# Altium schematic sheet Sheet1.SchDoc
size A
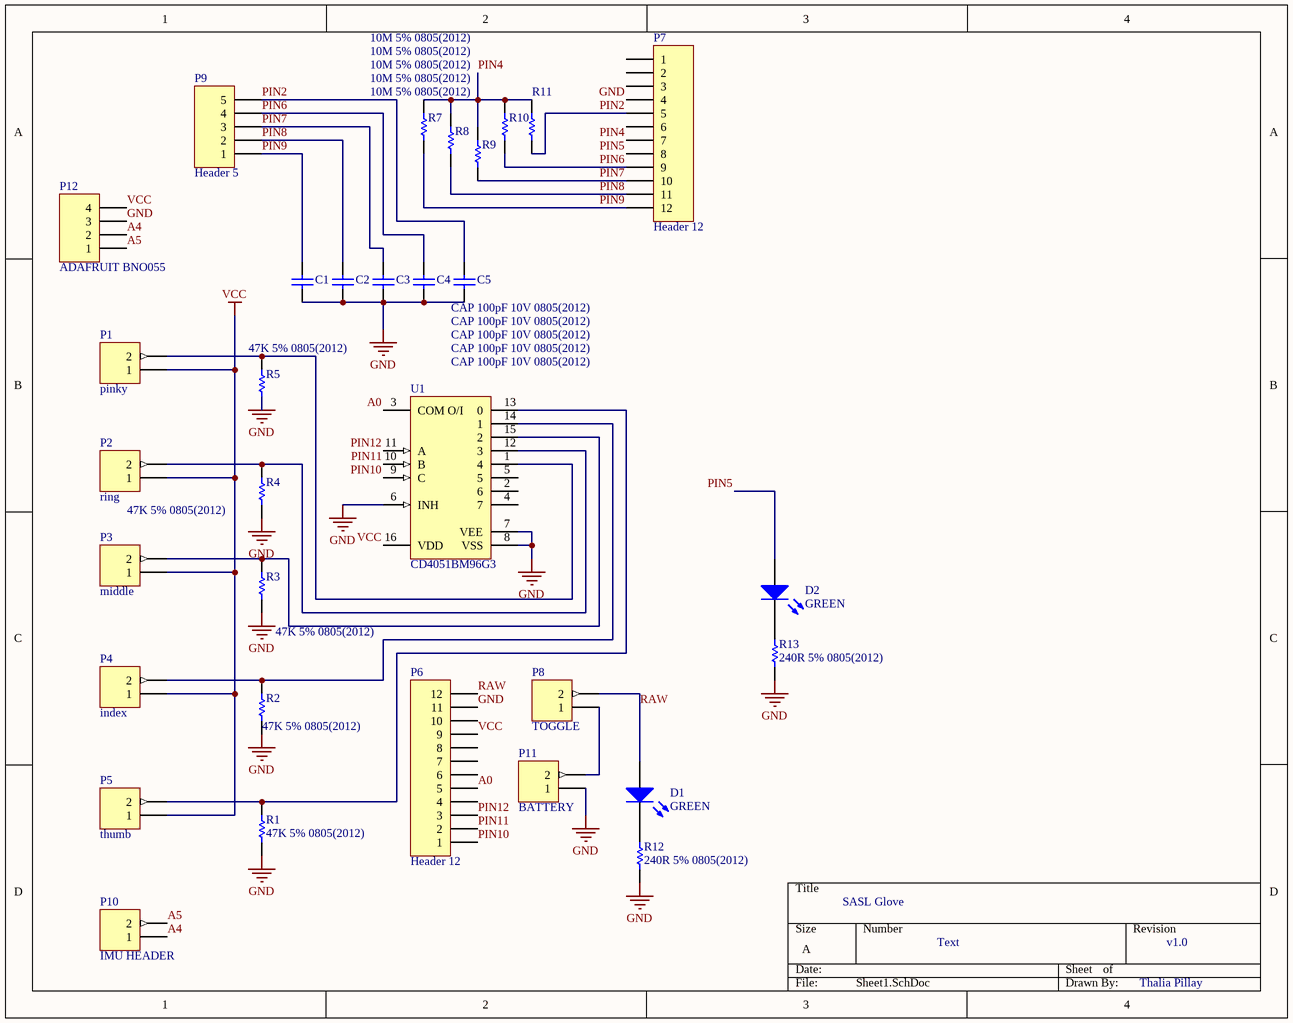
[diagram p0: Sheet1.SchDoc]

## Parts
C1  CAP 100pF 10V 0805(2012)  [CAPC0805(2012)100_M]
C2  CAP 100pF 10V 0805(2012)  [CAPC0805(2012)100_M]
C3  CAP 100pF 10V 0805(2012)  [CAPC0805(2012)100_M]
C4  CAP 100pF 10V 0805(2012)  [CAPC0805(2012)100_M]
C5  CAP 100pF 10V 0805(2012)  [CAPC0805(2012)100_M]
D1  GREEN  [3.2X1.6X1.1]
D2  GREEN  [3.2X1.6X1.1]
P1  pinky  [HDR1X2]
P2  ring  [HDR1X2]
P3  middle  [HDR1X2]
P4  index  [HDR1X2]
P5  thumb  [HDR1X2]
P6  Header 12  [HDR1X12]
P7  Header 12  [HDR1X12]
P8  TOGGLE  [HDR1X2]
P9  Header 5  [HDR1X5]
P10  IMU HEADER  [HDR1X2]
P11  BATTERY  [HDR1X2]
P12  ADAFRUIT BNO055  [HDR1X4]
R1  47K 5% 0805(2012)  [RESC0805(2012)_L]
R2  47K 5% 0805(2012)  [RESC0805(2012)_L]
R3  47K 5% 0805(2012)  [RESC0805(2012)_L]
R4  47K 5% 0805(2012)  [RESC0805(2012)_L]
R5  47K 5% 0805(2012)  [RESC0805(2012)_L]
R7  10M 5% 0805(2012)  [RESC0805(2012)_M]
R8  10M 5% 0805(2012)  [RESC0805(2012)_M]
R9  10M 5% 0805(2012)  [RESC0805(2012)_M]
R10  10M 5% 0805(2012)  [RESC0805(2012)_M]
R11  10M 5% 0805(2012)  [RESC0805(2012)_M]
R12  240R 5% 0805(2012)  [RESC0805(2012)_N]
R13  240R 5% 0805(2012)  [RESC0805(2012)_N]
U1  CD4051BM96G3  [D0016A_M]

## Nets
GND: C1.1 C2.1 C3.1 C4.1 C5.1 P6.11 P7.4 P11.1 P12.3 R1.1 R2.1 R3.1 R4.1 R5.1 R12.1 R13.1 U1.6(INH) U1.7(VEE) U1.8(VSS)
VCC: P1.1 P2.1 P3.1 P4.1 P5.1 P6.9 P12.4 U1.16(VDD)
A0: P6.5 U1.3(COM_O/I)
A4: P10.1 P12.2
A5: P10.2 P12.1
PIN2: C5.2 P7.5 P9.5 R11.1
PIN4: P7.7 R7.2 R8.2 R9.2 R10.2 R11.2
PIN5: D2.1(A) P7.8
PIN6: C4.2 P7.9 P9.4 R10.1
PIN7: C3.2 P7.10 P9.3 R9.1
PIN8: C2.2 P7.11 P9.2 R8.1
PIN9: C1.2 P7.12 P9.1 R7.1
PIN10: P6.1 U1.9(C)
PIN11: P6.2 U1.10(B)
PIN12: P6.3 U1.11(A)
RAW: D1.1(A) P6.12 P8.2
NetD1_2: D1.2(K) R12.2
NetD2_2: D2.2(K) R13.2
NetP1_2: P1.2 R5.2 U1.1(4)
NetP2_2: P2.2 R4.2 U1.12(3)
NetP3_2: P3.2 R3.2 U1.15(2)
NetP4_2: P4.2 R2.2 U1.14(1)
NetP5_2: P5.2 R1.2 U1.13(0)
NetP8_1: P8.1 P11.2

Not connected (* = marked no-connect by the designer): P6 4 6 7 8 10; P7 1 2 3 6; U1 2(6) 4(7) 5

## Notes on the sheet
- SASL Glove
- Text
- v1.0
- Thalia Pillay

## Library data of the parts
C1-C5 = CMP-1036-01932-1: CAP 100pF 10V ±5% 0805 (2012 Metric) Thickness 1mm SMD; Case-EIA: 0805; Case-Metric: 2012; Tolerance: Â±5%; Value: 100pF; Rated Voltage: 10 V; Technology: SMT; Max Thickness: 1 mm
D1 D2 = LED2: Typical RED, GREEN, YELLOW, AMBER GaAs LED; Published: 8-Jun-2000; LatestRevisionDate: 17-Jul-2002; LatestRevisionNote: Re-released for DXP Platform.; PackageVersion: Feb-2002; PackageReference: 3.2X1.6X1.1; Publisher: Altium Limited; PackageDescription: SM LED; 2 Flat Leads
P1-P5 P8 P10 P11 = Header 2: Header, 2-Pin; LatestRevisionDate: 17-Jul-2002; LatestRevisionNote: Re-released for DXP Platform.; Publisher: Altium Limited
P6 P7 = Header 12: Header, 12-Pin; LatestRevisionDate: 17-Jul-2002; LatestRevisionNote: Re-released for DXP Platform.; Publisher: Altium Limited
P9 = Header 5: Header, 5-Pin; LatestRevisionDate: 17-Jul-2002; LatestRevisionNote: Re-released for DXP Platform.; Publisher: Altium Limited
P12 = Header 4: Header, 4-Pin; LatestRevisionDate: 17-Jul-2002; LatestRevisionNote: Re-released for DXP Platform.; Publisher: Altium Limited
R1-R5 = CMP-1013-00114-1: 47K 0.125W 5% 0805 (2012 Metric)  SMD; Case-Metric: 2012; Case-EIA: 0805; Value: 47000.00 Ohm; Tolerance: 5 %; Power: 0.125 W; Technology: SMT
R7-R11 = CMP-1013-00170-1: 10M 0.125W 5% 0805 (2012 Metric)  SMD; Case-EIA: 0805; Value: 10000000.00 Ohm; Case-Metric: 2012; Power: 0.125 W; Tolerance: 5 %; Technology: SMT
R12 R13 = CMP-1013-00059-1: 240R 0.125W 5% 0805 (2012 Metric)  SMD; Value: 240.00 Ohm; Case-EIA: 0805; Case-Metric: 2012; Power: 0.125 W; Tolerance: 5 %; Technology: SMT
U1 = CMP-1575-00039-2: CMOS Single 8-Channel Analog Multiplexer/Demultiplexer with Logic-Level Conversion, D0016A, LARGE T&R; VCC(Min)(V): 5; Configuration: 1 X 1：8 MUX; Output Drive (IOL/IOH)(Max)(mA): 1; Rating: Military; VCC(Max)(V): 18; Ron(Typ)(Ohms): 125; Ron(Max)(Ohms): 240; Crosstalk: Yes; Bandwidth(Max)(MHz): 20; ICC(Typ)(mA): 0.00008; DatasheetVersion: SCHS047G; ComponentLink2Description: Datasheet; Operating Temperature Range(C): -55 to 125; ComponentLink1Description: Manufacturer URL; Part Number: CD4051B; ComponentLink2URL: http://www.ti.com/lit/ds/symlink/cd4051b.pdf; Code_IPC: MS-012 variation AC; PackageVersion: http://www.ti.com/lit/ml/mpds178g/mpds178g.pdf; Output Type: CMOS; ComponentLink1URL: http://www.ti.com/; PartNumber: CD4051BM96G3; PackageReference: D0016A